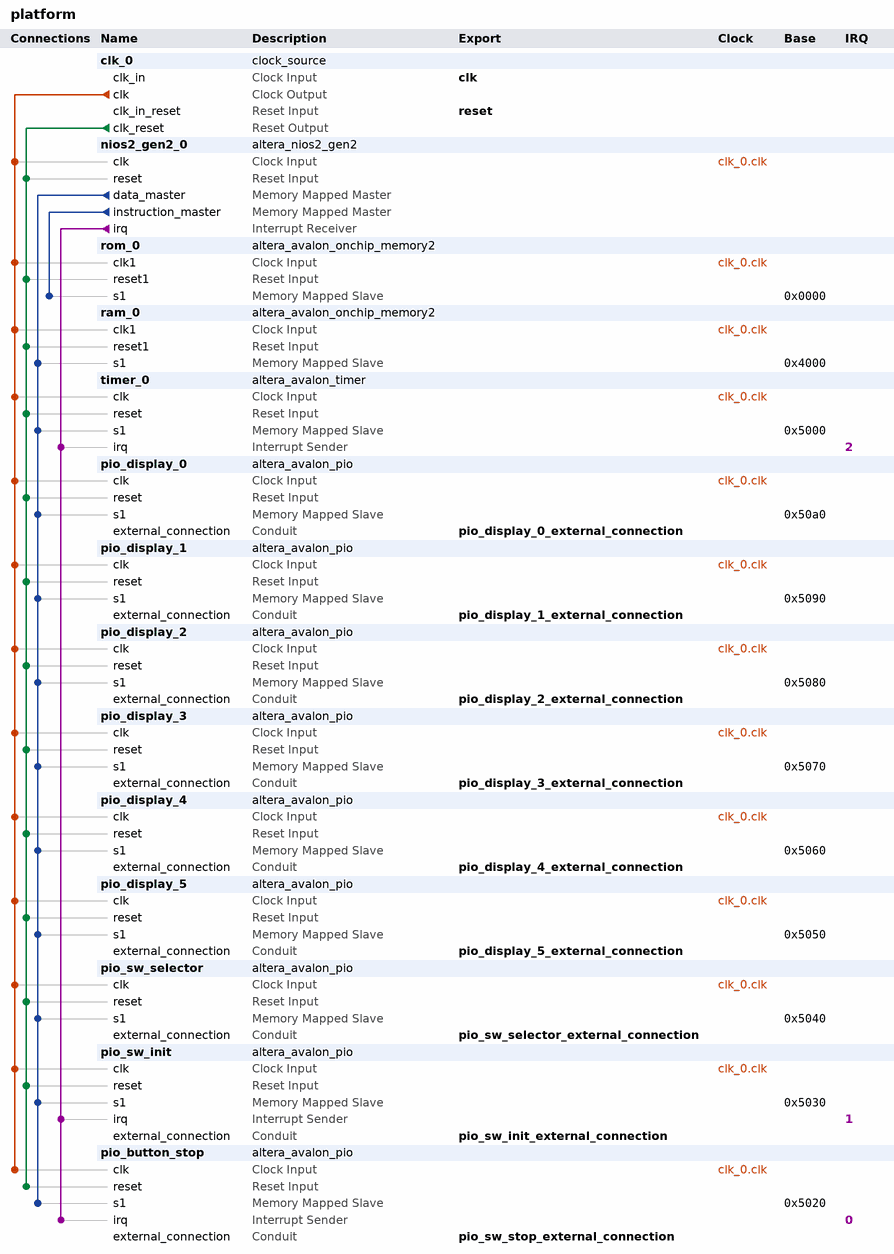
[diagram p0: system contents]
# Platform Designer (Qsys) system platform, Cyclone V 5CSEMA5F31C6
# Parameters at their usual value, and those the tool derives, are not listed.
package require -exact qsys 20.1
create_system platform
set_project_property DEVICE_FAMILY {Cyclone V}
set_project_property DEVICE 5CSEMA5F31C6

add_instance clk_0 clock_source 20.1
set_instance_parameter_value clk_0 clockFrequency 50000000

add_instance nios2_gen2_0 altera_nios2_gen2 20.1
set_instance_parameter_value nios2_gen2_0 dcache_size 2048
set_instance_parameter_value nios2_gen2_0 debug_enabled false
set_instance_parameter_value nios2_gen2_0 exceptionSlave rom_0.s1
set_instance_parameter_value nios2_gen2_0 icache_size 4096
set_instance_parameter_value nios2_gen2_0 impl Tiny
set_instance_parameter_value nios2_gen2_0 resetSlave rom_0.s1

add_instance rom_0 altera_avalon_onchip_memory2 20.1
set_instance_parameter_value rom_0 dataWidth 32
set_instance_parameter_value rom_0 dualPort false
set_instance_parameter_value rom_0 initMemContent true
set_instance_parameter_value rom_0 initializationFileName onchip_mem.hex
set_instance_parameter_value rom_0 memorySize 16384
set_instance_parameter_value rom_0 writable false

add_instance ram_0 altera_avalon_onchip_memory2 20.1
set_instance_parameter_value ram_0 dataWidth 32
set_instance_parameter_value ram_0 dualPort false
set_instance_parameter_value ram_0 initMemContent true
set_instance_parameter_value ram_0 initializationFileName onchip_mem.hex
set_instance_parameter_value ram_0 memorySize 4096

add_instance timer_0 altera_avalon_timer 20.1
set_instance_parameter_value timer_0 alwaysRun true
set_instance_parameter_value timer_0 fixedPeriod true
set_instance_parameter_value timer_0 period 1
set_instance_parameter_value timer_0 periodUnits MSEC
set_instance_parameter_value timer_0 snapshot false

add_instance pio_display_0 altera_avalon_pio 20.1
set_instance_parameter_value pio_display_0 direction Output
set_instance_parameter_value pio_display_0 width 7

add_instance pio_display_1 altera_avalon_pio 20.1
set_instance_parameter_value pio_display_1 direction Output
set_instance_parameter_value pio_display_1 width 7

add_instance pio_display_2 altera_avalon_pio 20.1
set_instance_parameter_value pio_display_2 direction Output
set_instance_parameter_value pio_display_2 width 7

add_instance pio_display_3 altera_avalon_pio 20.1
set_instance_parameter_value pio_display_3 direction Output
set_instance_parameter_value pio_display_3 width 7

add_instance pio_display_4 altera_avalon_pio 20.1
set_instance_parameter_value pio_display_4 direction Output
set_instance_parameter_value pio_display_4 width 7

add_instance pio_display_5 altera_avalon_pio 20.1
set_instance_parameter_value pio_display_5 direction Output
set_instance_parameter_value pio_display_5 width 7

add_instance pio_sw_selector altera_avalon_pio 20.1
set_instance_parameter_value pio_sw_selector direction Input
set_instance_parameter_value pio_sw_selector width 2

add_instance pio_sw_init altera_avalon_pio 20.1
set_instance_parameter_value pio_sw_init direction Input
set_instance_parameter_value pio_sw_init generateIRQ true
set_instance_parameter_value pio_sw_init width 1

add_instance pio_button_stop altera_avalon_pio 20.1
set_instance_parameter_value pio_button_stop direction Input
set_instance_parameter_value pio_button_stop generateIRQ true
set_instance_parameter_value pio_button_stop width 1

# connections
add_connection clk_0.clk nios2_gen2_0.clk clock
add_connection clk_0.clk pio_button_stop.clk clock
add_connection clk_0.clk pio_display_0.clk clock
add_connection clk_0.clk pio_display_1.clk clock
add_connection clk_0.clk pio_display_2.clk clock
add_connection clk_0.clk pio_display_3.clk clock
add_connection clk_0.clk pio_display_4.clk clock
add_connection clk_0.clk pio_display_5.clk clock
add_connection clk_0.clk pio_sw_init.clk clock
add_connection clk_0.clk pio_sw_selector.clk clock
add_connection clk_0.clk ram_0.clk1 clock
add_connection clk_0.clk rom_0.clk1 clock
add_connection clk_0.clk timer_0.clk clock
add_connection clk_0.clk_reset nios2_gen2_0.reset reset
add_connection clk_0.clk_reset pio_button_stop.reset reset
add_connection clk_0.clk_reset pio_display_0.reset reset
add_connection clk_0.clk_reset pio_display_1.reset reset
add_connection clk_0.clk_reset pio_display_2.reset reset
add_connection clk_0.clk_reset pio_display_3.reset reset
add_connection clk_0.clk_reset pio_display_4.reset reset
add_connection clk_0.clk_reset pio_display_5.reset reset
add_connection clk_0.clk_reset pio_sw_init.reset reset
add_connection clk_0.clk_reset pio_sw_selector.reset reset
add_connection clk_0.clk_reset ram_0.reset1 reset
add_connection clk_0.clk_reset rom_0.reset1 reset
add_connection clk_0.clk_reset timer_0.reset reset
add_connection nios2_gen2_0.data_master pio_button_stop.s1 avalon
set_connection_parameter_value nios2_gen2_0.data_master/pio_button_stop.s1 baseAddress 0x5020
add_connection nios2_gen2_0.data_master pio_display_0.s1 avalon
set_connection_parameter_value nios2_gen2_0.data_master/pio_display_0.s1 baseAddress 0x50a0
add_connection nios2_gen2_0.data_master pio_display_1.s1 avalon
set_connection_parameter_value nios2_gen2_0.data_master/pio_display_1.s1 baseAddress 0x5090
add_connection nios2_gen2_0.data_master pio_display_2.s1 avalon
set_connection_parameter_value nios2_gen2_0.data_master/pio_display_2.s1 baseAddress 0x5080
add_connection nios2_gen2_0.data_master pio_display_3.s1 avalon
set_connection_parameter_value nios2_gen2_0.data_master/pio_display_3.s1 baseAddress 0x5070
add_connection nios2_gen2_0.data_master pio_display_4.s1 avalon
set_connection_parameter_value nios2_gen2_0.data_master/pio_display_4.s1 baseAddress 0x5060
add_connection nios2_gen2_0.data_master pio_display_5.s1 avalon
set_connection_parameter_value nios2_gen2_0.data_master/pio_display_5.s1 baseAddress 0x5050
add_connection nios2_gen2_0.data_master pio_sw_init.s1 avalon
set_connection_parameter_value nios2_gen2_0.data_master/pio_sw_init.s1 baseAddress 0x5030
add_connection nios2_gen2_0.data_master pio_sw_selector.s1 avalon
set_connection_parameter_value nios2_gen2_0.data_master/pio_sw_selector.s1 baseAddress 0x5040
add_connection nios2_gen2_0.data_master ram_0.s1 avalon
set_connection_parameter_value nios2_gen2_0.data_master/ram_0.s1 baseAddress 0x4000
add_connection nios2_gen2_0.data_master timer_0.s1 avalon
set_connection_parameter_value nios2_gen2_0.data_master/timer_0.s1 baseAddress 0x5000
add_connection nios2_gen2_0.instruction_master rom_0.s1 avalon
set_connection_parameter_value nios2_gen2_0.instruction_master/rom_0.s1 baseAddress 0x0000
add_connection nios2_gen2_0.irq pio_button_stop.irq interrupt
set_connection_parameter_value nios2_gen2_0.irq/pio_button_stop.irq irqNumber 0
add_connection nios2_gen2_0.irq pio_sw_init.irq interrupt
set_connection_parameter_value nios2_gen2_0.irq/pio_sw_init.irq irqNumber 1
add_connection nios2_gen2_0.irq timer_0.irq interrupt
set_connection_parameter_value nios2_gen2_0.irq/timer_0.irq irqNumber 2

# exported interfaces
add_interface clk clock sink
set_interface_property clk EXPORT_OF clk_0.clk_in
add_interface pio_display_0_external_connection conduit end
set_interface_property pio_display_0_external_connection EXPORT_OF pio_display_0.external_connection
add_interface pio_display_1_external_connection conduit end
set_interface_property pio_display_1_external_connection EXPORT_OF pio_display_1.external_connection
add_interface pio_display_2_external_connection conduit end
set_interface_property pio_display_2_external_connection EXPORT_OF pio_display_2.external_connection
add_interface pio_display_3_external_connection conduit end
set_interface_property pio_display_3_external_connection EXPORT_OF pio_display_3.external_connection
add_interface pio_display_4_external_connection conduit end
set_interface_property pio_display_4_external_connection EXPORT_OF pio_display_4.external_connection
add_interface pio_display_5_external_connection conduit end
set_interface_property pio_display_5_external_connection EXPORT_OF pio_display_5.external_connection
add_interface pio_sw_init_external_connection conduit end
set_interface_property pio_sw_init_external_connection EXPORT_OF pio_sw_init.external_connection
add_interface pio_sw_selector_external_connection conduit end
set_interface_property pio_sw_selector_external_connection EXPORT_OF pio_sw_selector.external_connection
add_interface pio_sw_stop_external_connection conduit end
set_interface_property pio_sw_stop_external_connection EXPORT_OF pio_button_stop.external_connection
add_interface reset reset sink
set_interface_property reset EXPORT_OF clk_0.clk_in_reset

set_interconnect_requirement {$system} qsys_mm.clockCrossingAdapter HANDSHAKE
set_interconnect_requirement {$system} qsys_mm.enableEccProtection FALSE
set_interconnect_requirement {$system} qsys_mm.insertDefaultSlave FALSE
set_interconnect_requirement {$system} qsys_mm.maxAdditionalLatency 1

save_system platform.qsys
